# EAGLE design DATALOGGER_POWER_V1 (EAGLE 9.5.1)
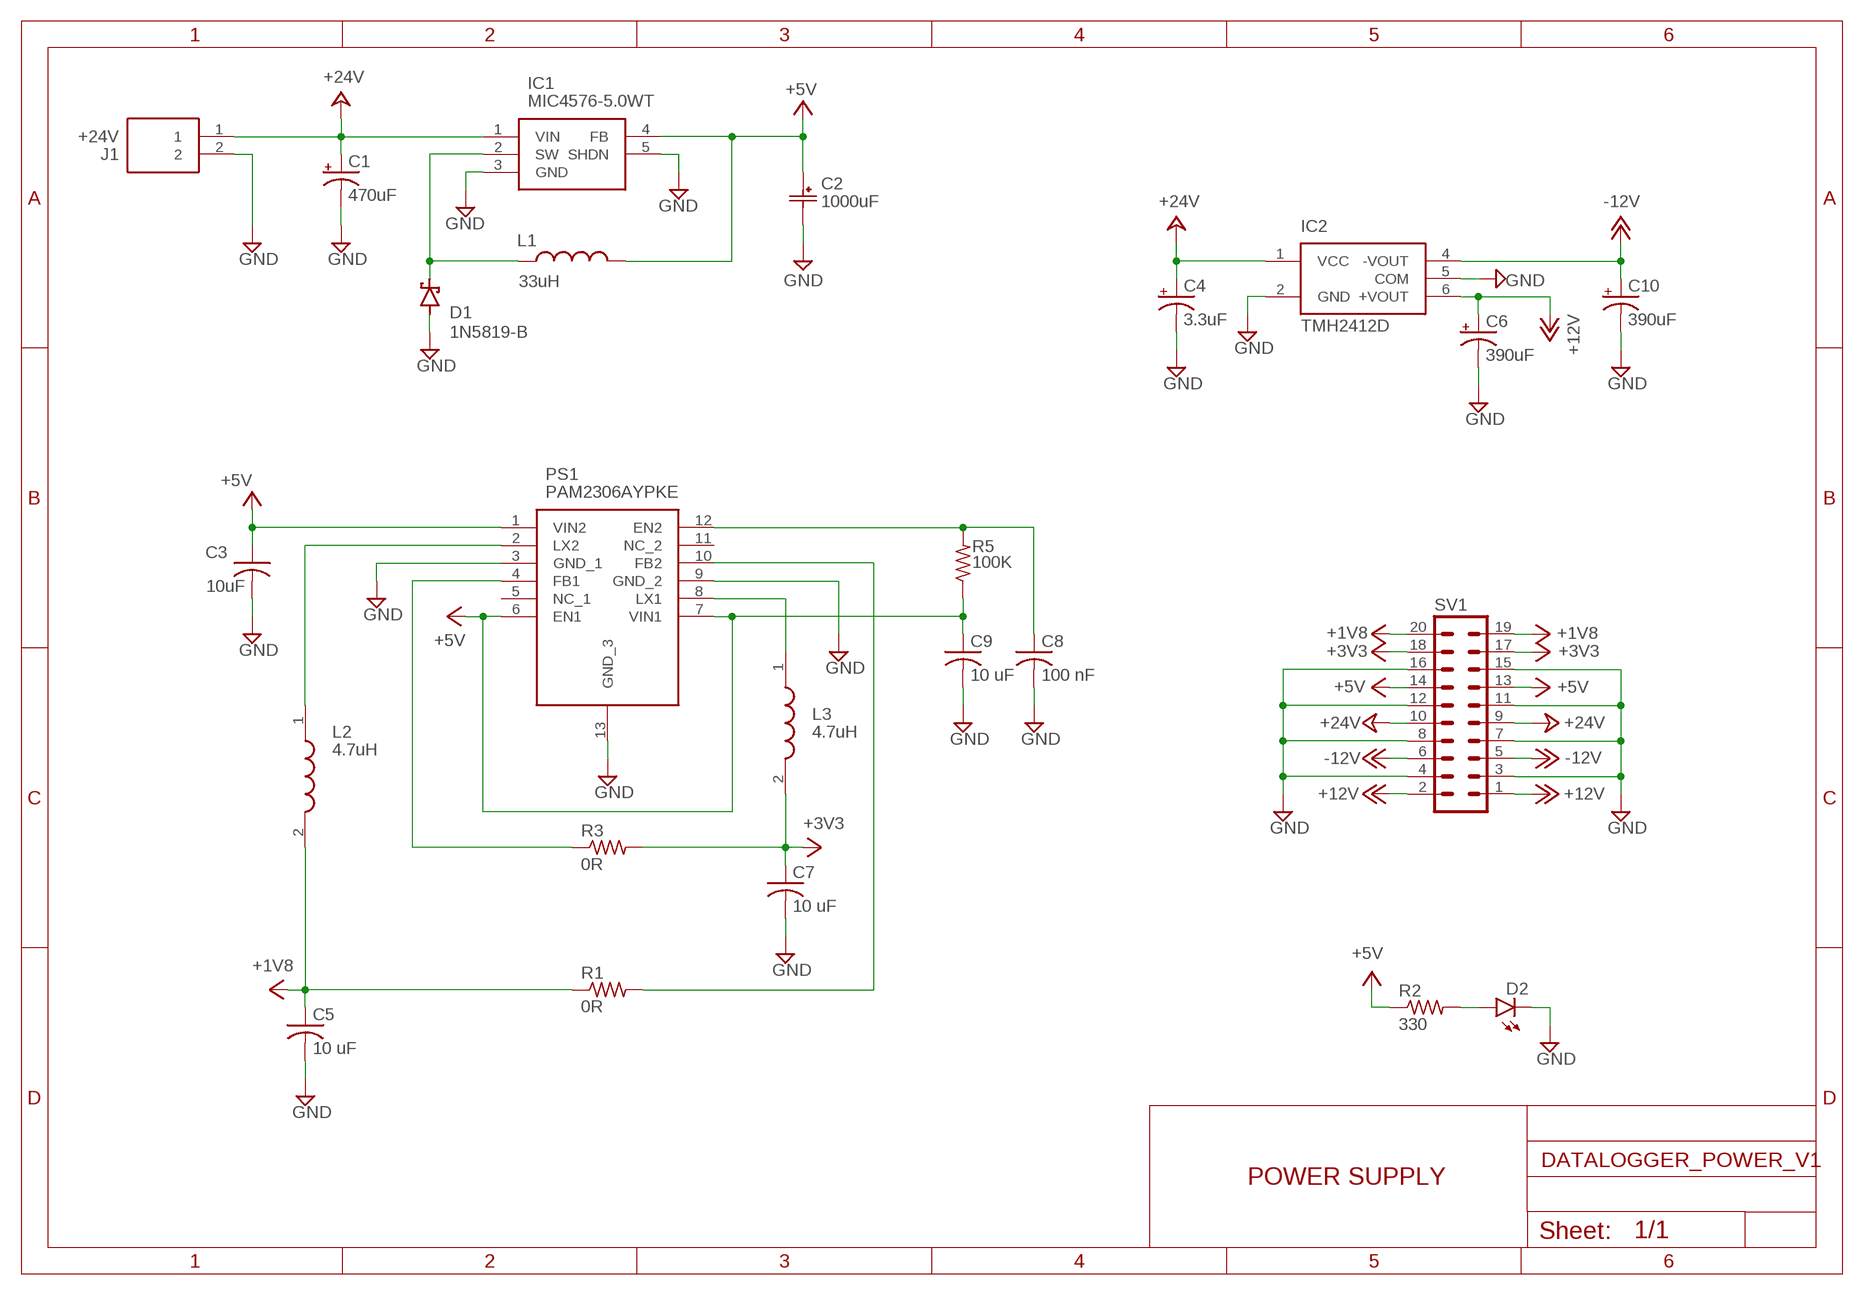
[diagram p0: schematic, sheet 1]

## Parts
C1  470uF  CPOL-USE5-13  [E5-13]
C2  1000uF  UCZ1V102MNQ1MS  [CAP_UCD_16X16P5_NCH]
C3  10uF  C-USC1206  [C1206]
C4  3.3uF  CPOL-USE2-4  [E2-4]
C5  10 uF  C-USC1206  [C1206]
C6  390uF  CPOL-USE2-4  [E2-4]
C7  10 uF  C-USC1206  [C1206]
C8  100 nF  C-USC1206  [C1206]
C9  10 uF  C-USC1206  [C1206]
C10  390uF  CPOL-USE2-4  [E2-4]
D1  1N5819-B  [DO41-7.6]
D2  LEDCHIPLED_1206  [CHIPLED_1206]
IC1  MIC4576-5.0WT  [TO170P470X1016X1600-5P]
IC2  TMH2412D  [TMH2412D]
J1  +24V  1711026  [SHDR2W110P0X500_1X2_1000X1120X]
L1  33uH  HCMA1707-330-R  [HCMA1707-330-R]
L2  4.7uH  SRN4018-4R7M  [SRN4018]
L3  4.7uH  SRN4018-4R7M  [SRN4018]
PS1  PAM2306AYPKE  [SON45P300X300X80-13N]
R1  0R  R-US_R1206  [R1206]
R2  330  R-US_R1206  [R1206]
R3  0R  R-US_R1206  [R1206]
R5  100K  R-US_R1206  [R1206]
SV1  MA10-2  [MA10-2]

## Nets
+1V8: C5.1 L2.2 R1.1 SV1.19 SV1.20
+3V3: C7.1 L3.2 R3.2 SV1.17 SV1.18
+5V: C2.1 C3.1 C9.1 IC1.4(FB) L1.2 PS1.1(VIN2) PS1.6(EN1) PS1.7(VIN1) R2.1 R5.1 SV1.13 SV1.14
+12V: C6.+ IC2.6(+VOUT) SV1.1 SV1.2
+24V: C1.+ C4.+ IC1.1(VIN) IC2.1(VCC) J1.1 SV1.9 SV1.10
-12V: C10.+ IC2.4(-VOUT) SV1.5 SV1.6
GND: C1.- C2.2 C3.2 C4.- C5.2 C6.- C7.2 C8.2 C9.2 C10.- D1.A D2.C IC1.3(GND) IC1.5(SHDN) IC2.2(GND) IC2.5(COM) J1.2 PS1.3(GND_1) PS1.9(GND_2) PS1.13(GND_3) SV1.3 SV1.4 SV1.7 SV1.8 SV1.11 SV1.12 SV1.15 SV1.16
N$1: D2.A R2.2
N$2: D1.C IC1.2(SW) L1.1
N$4: L3.1 PS1.8(LX1)
N$5: L2.1 PS1.2(LX2)
N$6: PS1.10(FB2) R1.2
N$8: PS1.4(FB1) R3.1
N$10: C8.1 PS1.12(EN2) R5.2
Unconnected: PS1.5(NC_1) PS1.11(NC_2)

## Notes on the sheet
- POWER SUPPLY

## Library data of the parts
C1 C4 C6 C10 = rcl:CPOL-US: POLARIZED CAPACITOR, American symbol; SPICEPREFIX: C
C2 = UCZ1V102MNQ1MS:UCZ1V102MNQ1MS; BUILT_BY: EMA_Cory; COPYRIGHT: Copyright (C) 2018 Accelerated Designs. All rights reserved; MANUFACTURER_PART_NUMBER: UCZ1V102MNQ1MS; SOURCELIBRARY: Nichicon_2019-09-13; VENDOR: Nichicon
C3 C5 C7-C9 = rcl:C-US: CAPACITOR, American symbol
D1 = diode:1N581*: 1.0A SCHOTTKY BARRIER RECTIFIER Source: http://www.diodes.com/datasheets/ds23001.pdf
D2 = led:LED: LED OSRAM: - CHIPLED LG R971, LG N971, LY N971, LG Q971, LY Q971, LO R971, LY R971 LH N974, LH R974 LS Q976, LO Q976, LY Q976 LO Q996 - Hyper CHIPLED LW Q18S LB Q993, LB Q99A, LB R99A - SideLED LS A670, LO A670, LY A670, LG A670, LP A670 LB A673, LV A673, LT A673, LW A673 LH A674 LY A675 LS A676, LA A676, LO A676, LY A676, LW A676 LS A679, LY A679, LG A679 - Hyper Micro SIDELED® LS Y876, LA Y876, LO Y876, LY Y876 LT Y87S - SmartLED LW L88C, LW L88S LB L89C, LB L89S, LG L890 LS L89K, LO L89K, LY L89K LS L896, LA L896, LO L896, LY L896 - TOPLED LS T670, LO T670, LY T670, LG T670, LP T670 LSG T670, LSP T670, LSY T670, LOP T670, LYG T670 LG T671, LOG T671, LSG T671 LB T673, LV T673, LT T673, LW T673 LH T674 LS T676, LA T676, LO T676, LY T676, LB T676, LH T676, LSB T676, LW T676 LB T67C, LV T67C, LT T67C, LS T67K, LO T67K, LY T67K, LW E67C LS E67B, LA E67B, LO E67B, LY E67B, LB E67C, LV E67C, LT E67C LW T67C LS T679, LY T679, LG T679 LS T770, LO T770, LY T770, LG T770, LP T770 LB T773, LV T773, LT T773, LW T773 LH T774 LS E675, LA E675, LY E675, LS T675 LS T776, LA T776, LO T776, LY T776, LB T776 LHGB T686 LT T68C, LB T68C - Hyper Mini TOPLED® LB M676 - Mini TOPLED Santana® LG M470 LS M47K, LO M47K, LY M47K Source: http://www.osram.convergy.de LUXEON: - LUMILED® LXK2-PW12-R00, LXK2-PW12-S00, LXK2-PW14-U00, LXK2-PW14-V00 LXK2-PM12-R00, LXK2-PM12-S00, LXK2-PM14-U00 LXK2-PE12-Q00, LXK2-PE12-R00, LXK2-PE12-S00, LXK2-PE14-T00, LXK2-PE14-U00 LXK2-PB12-K00, LXK2-PB12-L00, LXK2-PB12-M00, LXK2-PB14-N00, LXK2-PB14-P00, LXK2-PB14-Q00 LXK2-PR12-L00, LXK2-PR12-M00, LXK2-PR14-Q00, LXK2-PR14-R00 LXK2-PD12-Q00, LXK2-PD12-R00, LXK2-PD12-S00 LXK2-PH12-R00, LXK2-PH12-S00 LXK2-PL12-P00, LXK2-PL12-Q00, LXK2-PL12-R00 Source: www.luxeon.com KINGBRIGHT: KA-3528ASYC Source: www.kingbright.com
IC1 = SamacSys_Parts:MIC4576-5.0WT: Switching Voltage Regulators 200kHz 3.0A Step-down Regulator Source: Datasheet <http://ww1.microchip.com/downloads/en/devicedoc/mic4576.pdf>; DESCRIPTION: Switching Voltage Regulators 200kHz 3.0A Step-down Regulator; HEIGHT: 4.7mm; MANUFACTURER_NAME: Microchip; MANUFACTURER_PART_NUMBER: MIC4576-5.0WT; MOUSER_PART_NUMBER: 998-MIC4576-5.0WT; MOUSER_PRICE-STOCK: https://www.mouser.co.uk/ProductDetail/Microchip-Technology-Micrel/MIC4576-50WT?qs=kh6iOki%2FeLEIhSt6WnGdnw%3D%3D
IC2 = TMH 2412D:TMH2412D
J1 = SamacSys_Parts:1711026: CONNECTOR Phoenix Contact PCB Terminal Block, 2 Way, 30 12 AWG, Polyamide, 630 V Source: Datasheet <https://componentsearchengine.com/Datasheets/1/1711026.pdf>; DESCRIPTION: CONNECTOR Phoenix Contact PCB Terminal Block, 2 Way, 30 12 AWG, Polyamide, 630 V; HEIGHT: 18mm; MANUFACTURER_NAME: Phoenix Contact; MANUFACTURER_PART_NUMBER: 1711026; MOUSER_PART_NUMBER: 651-1711026; MOUSER_PRICE-STOCK: https://www.mouser.com/Search/Refine.aspx?Keyword=651-1711026
L1 = HCMA1707-330-R2:HCMA1707-330-R
L2 L3 = SamacSys_Parts:SRN4018-4R7M: Inductor SMD 4x4 semi-shielded 4,7uH Bourns SRN4018 Series Shielded Wire-wound SMD Inductor with a Ferrite Core, 4.7 uH +/-20% Wire-Wound 1.9A rms Idc Source: Datasheet <https://componentsearchengine.com/Datasheets/1/SRN4018-4R7M.pdf>; DESCRIPTION: Inductor SMD 4x4 semi-shielded 4,7uH Bourns SRN4018 Series Shielded Wire-wound SMD Inductor with a Ferrite Core, 4.7 uH +/-20% Wire-Wound 1.9A rms Idc; HEIGHT: mm; MANUFACTURER_NAME: Bourns; MANUFACTURER_PART_NUMBER: SRN4018-4R7M; MOUSER_PART_NUMBER: 652-SRN4018-4R7M; MOUSER_PRICE-STOCK: https://www.mouser.com/Search/Refine.aspx?Keyword=652-SRN4018-4R7M
PS1 = SamacSys_Parts:PAM2306AYPKE: DUAL PWM ST-DOWN DC-DC CONVerter DiodesZetex PAM2306AYPKE, Dual Step Down DC-DC Converter, 1A, Maximum of 3.3 V, 12-Pin WDFN Source: Datasheet <https://componentsearchengine.com/Datasheets/1/PAM2306AYPKE.pdf>; DESCRIPTION: DUAL PWM ST-DOWN DC-DC CONVerter DiodesZetex PAM2306AYPKE, Dual Step Down DC-DC Converter, 1A, Maximum of 3.3 V, 12-Pin WDFN; HEIGHT: 0.8mm; MANUFACTURER_NAME: Diodes Inc.; MANUFACTURER_PART_NUMBER: PAM2306AYPKE; MOUSER_PART_NUMBER: 621-PAM2306AYPKE; MOUSER_PRICE-STOCK: https://www.mouser.com/Search/Refine.aspx?Keyword=621-PAM2306AYPKE; RS_PART_NUMBER: 9210751P; RS_PRICE-STOCK: http://uk.rs-online.com/web/p/products/9210751P
R1-R3 R5 = rcl:R-US_: RESISTOR, American symbol; SPICEPREFIX: R
SV1 = con-lstb:MA10-2: PIN HEADER; OC_FARNELL: unknown; OC_NEWARK: unknown

## Board
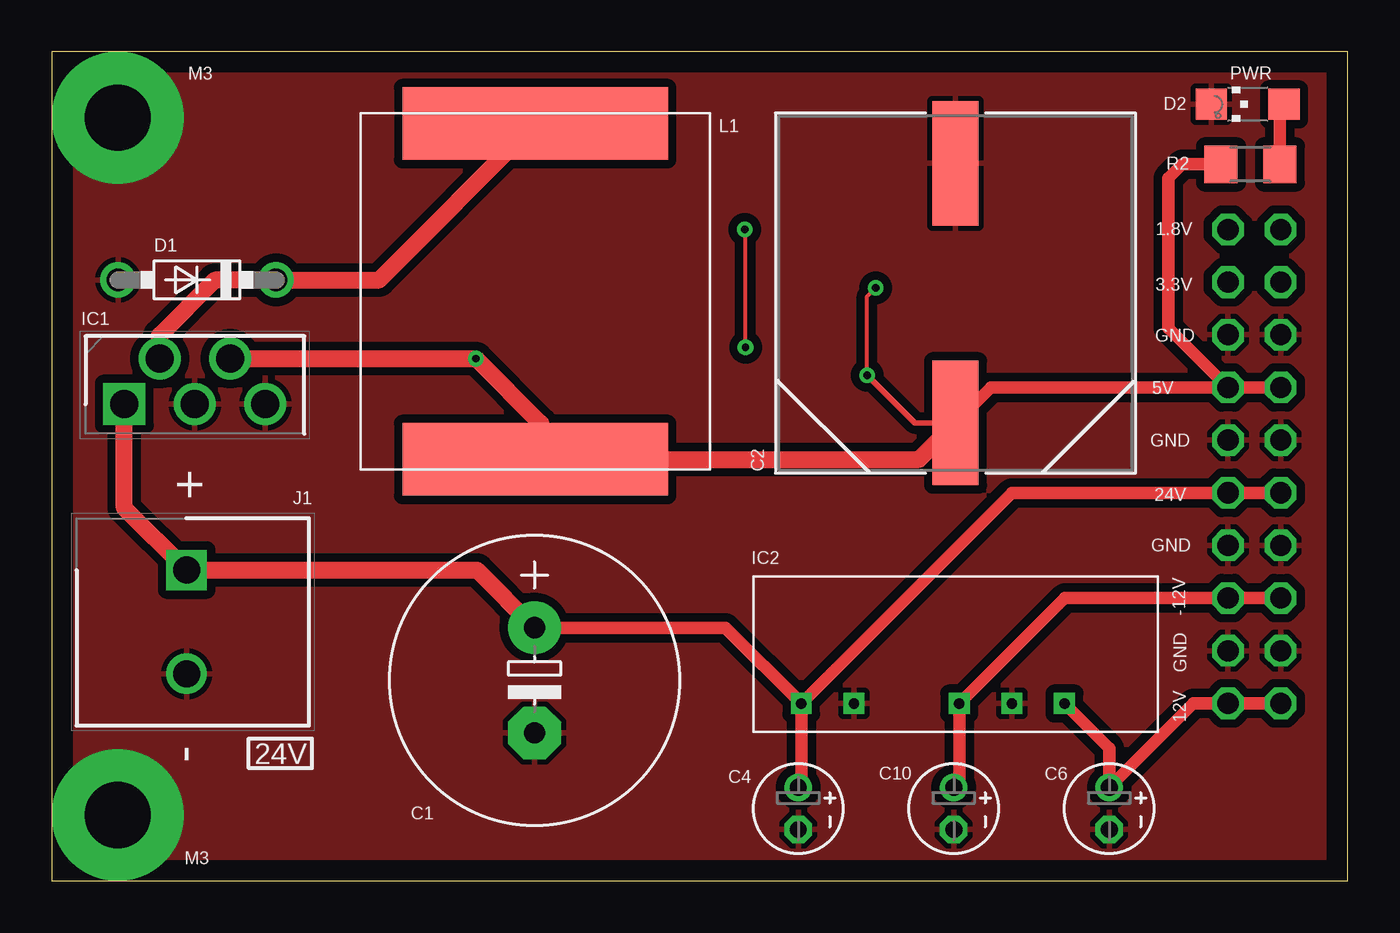
[diagram p1: board, top side]
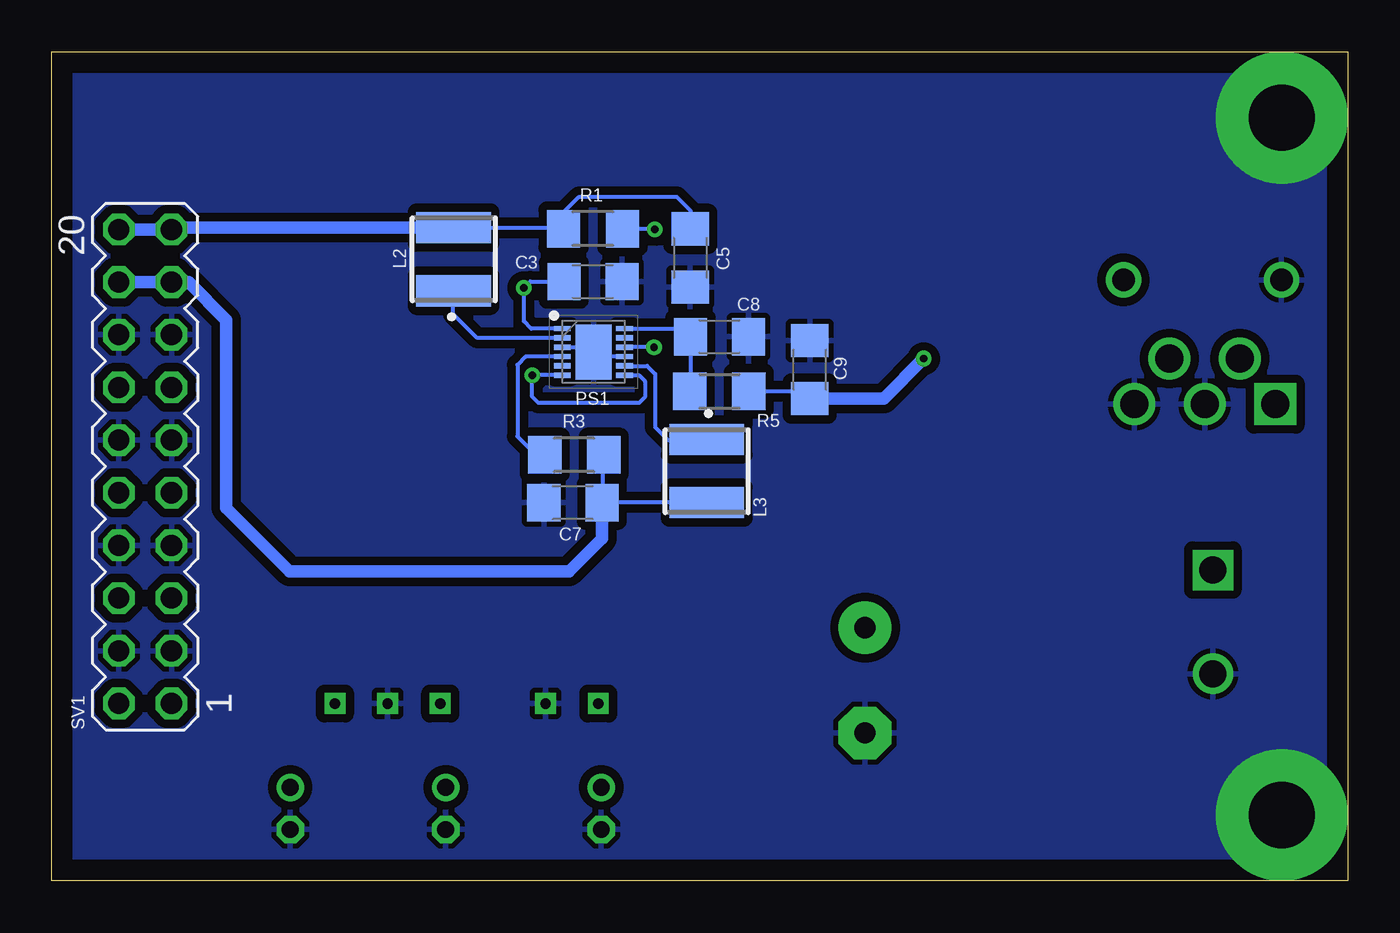
[diagram p2: board, bottom side, seen from below]

Size 62.5 x 40 mm. Coordinates in mm from the lower left corner, seen from the top.
Outline: 0,0 62.5,0 62.5,40 0,40 0,0
Copper layers (1*16): Top 0.035mm / dielectric 1.5mm / Bottom 0.035mm
Design rules "default": minimum track width 6mil, minimum drill 0.35mm, track to track 6mil, track to pad 6mil, pad to pad 6mil, via to via 6mil, smd to smd 6mil, copper to edge 40mil, drill to drill 6mil, minimum pad ring 10mil, minimum via ring 8mil, stop-mask expansion 4mil, vias tented up to drill 0mil, thermal gap 10mil

### Footprints (pad centres in the part's own frame; a part is rotated, then mirrored left to right if it is on the bottom)
E5-13 = drill 1.016 pad 2.54: + -2.54,0 | drill 1.016 pad 2.54 octagon: - 2.54,0
CAP_UCD_16X16P5_NCH = smd 5.994 x 2.21: 1 -6.261,0; 2 6.261,0
C1206 = smd 1.6 x 1.8: 1 -1.4,0; 2 1.4,0
E2-4 = drill 0.813 pad 1.27: + -1.016,0 | drill 0.813 pad 1.27 octagon: - 1.016,0
DO41-7.6 = drill 1.1 pad 1.7: A 3.81,0; C -3.81,0
CHIPLED_1206 = smd 1.5 x 1.5: A 0,-1.75; C 0,1.75
TO170P470X1016X1600-5P = drill 1.35 pad 2.025 square: 1 0,0 | drill 1.35 pad 2.025: 2 1.7,2.2; 3 3.4,0; 4 5.1,2.2; 5 6.8,0
TMH2412D = drill 0.5 square: 1 2.3,1.375; 2 4.84,1.375; 4 9.92,1.375; 5 12.46,1.375; 6 15,1.375
SHDR2W110P0X500_1X2_1000X1120X = drill 1.3 pad 1.95 square: 1 0,0 | drill 1.3 pad 1.95: 2 5,0
HCMA1707-330-R = smd 3.5 x 12.8: 1 0.5,-8.425; 2 16.7,-8.425
SRN4018 = smd 1.5 x 3.6: 1 -1.525,0; 2 1.525,0
SON45P300X300X80-13N = smd 0.8 x 0.25: 1 -1.5,1.125; 2 -1.5,0.675; 3 -1.5,0.225; 4 -1.5,-0.225; 5 -1.5,-0.675; 6 -1.5,-1.125; 7 1.5,-1.125; 8 1.5,-0.675; 9 1.5,-0.225; 10 1.5,0.225; 11 1.5,0.675; 12 1.5,1.125 | smd 1.75 x 2.65: 13 0,0
R1206 = smd 1.6 x 1.803: 1 -1.422,0; 2 1.422,0
MA10-2 = drill 1.016 octagon: 1 -11.43,-1.27; 2 -11.43,1.27; 3 -8.89,-1.27; 4 -8.89,1.27; 5 -6.35,-1.27; 6 -6.35,1.27; 7 -3.81,-1.27; 8 -3.81,1.27; 9 -1.27,-1.27; 10 -1.27,1.27; 11 1.27,-1.27; 12 1.27,1.27; 13 3.81,-1.27; 14 3.81,1.27; 15 6.35,-1.27; 16 6.35,1.27; 17 8.89,-1.27; 18 8.89,1.27; 19 11.43,-1.27; 20 11.43,1.27

### Placement (x,y rotation side)
C1  23.28,9.68 270 top
C2  43.59,28.36 90 top
C3  36.4,28.91 0 bottom
C4  36,3.5 270 top
C5  31.71,30.06 270 bottom
C6  51,3.5 270 top
C7  37.37,18.25 180 bottom
C8  30.3,26.26 0 bottom
C9  25.94,24.67 90 bottom
C10  43.5,3.5 270 top
D1  7,29 180 top
D2  57.68,37.47 90 top
IC1  3.5,23 0 top
IC2  33.85,7.18 0 top
J1  6.5,15 270 top
L1  31.74,37.04 270 top
L2  43.12,30 90 bottom
L3  30.91,19.78 270 bottom
PS1  36.38,25.52 0 bottom
R1  36.4,31.47 0 bottom
R2  57.81,34.57 0 top
R3  37.3,20.56 0 bottom
R5  30.31,23.63 180 bottom
SV1  58,20 90 bottom

### Tracks (layer width: path | path; a pad name or v marks a point on that pad's centre or on a via)
+1V8
  Bottom 0.2: L2.2 37.88,31.52 R1.1 37.82,32.26 37.07,33.01 32.37,33.01 31.7,32.34 C5.1
  Bottom 0.61: L2.2 57.02,31.52 SV1.19 SV1.20
+3V3
  Bottom 0.2: L3.2 C7.1 | C7.1 | R3.2 35.94,20.5 35.94,18.28 C7.1
  Bottom 0.61: C7.1 35.97,16.53 37.56,14.94 51.03,14.94 54.09,18 54.09,27.07 55.91,28.89 SV1.17 SV1.18
+5V  (via drill 0.35)
  Top 0.2: v39.32,24.4 39.32,28.2 v39.73,28.61
  Top 0.254: v39.32,24.4 41.62,22.1 C2.1
  Top 0.61: C2.1 45.3,23.81 SV1.13 | SV1.13 SV1.14 | R2.1 54.52,34.57 53.86,33.91 53.86,26.68 SV1.13
  Top 0.813: IC1.4 v20.45,25.2 23.58,22.07 23.58,20.6 L1.2 41.83,20.34 C2.1
  Bottom 0.2: PS1.1 39.38,26.65 39.73,27 v39.73,28.61 39.42,28.92 C3.1 | PS1.6 v39.32,24.4 | v39.32,24.4 | R5.1 26.3,23.63 C9.1 | PS1.7 34.18,24.4 33.89,24.11 33.89,23.34 34.17,23.06 39.03,23.06 39.33,23.36 39.33,24.39 v39.32,24.4
  Bottom 0.61: C9.1 22.38,23.27 v20.45,25.2
+12V
  Top 0.61: IC2.6 51,6.41 C6.+ 55.05,8.57 SV1.1 SV1.2
+24V
  Top 0.61: IC2.1 32.48,12.22 C1.+ | IC2.1 36.15,4.66 C4.+ | IC2.1 46.31,18.73 SV1.9 SV1.10
  Top 0.813: IC1.1 3.5,18 J1.1 20.5,15 C1.+
-12V
  Top 0.61: C10.+ 43.77,4.78 IC2.4 48.85,13.65 SV1.5 SV1.6
GND  (via drill 3.2 pad 6.35)
  Bottom 0.2: PS1.9 36.15,25.3 PS1.13 36.6,25.75 PS1.3
  other vias: 3.17,36.83 3.17,3.17
  pour Top (isolate 0.406): 0,40 0,0 62.5,0 62.5,40
  pour Bottom (isolate 0.406): 0,40 0,0 62.5,0 62.5,40
N$1
  Top 0.61: R2.2 59.23,37.27 D2.A
N$2
  Top 0.813: IC1.2 5.2,26.32 7.86,28.98 10.79,28.98 D1.C 15.78,29 L1.1
N$4
  Bottom 0.2: PS1.8 33.79,24.85 33.4,24.46 33.4,21.89 32.78,21.27 30.95,21.27 L3.1
N$5
  Bottom 0.2: PS1.2 41.99,26.2 43.14,27.35 43.14,28.45 L2.1
N$6  (via drill 0.35)
  Top 0.2: v33.42,31.44 33.42,25.79 v33.46,25.75
  Bottom 0.2: R1.2 33.45,31.47 v33.42,31.44 | v33.46,25.75 PS1.10
N$8
  Bottom 0.2: PS1.4 39.64,25.3 40.04,24.9 40.04,21.45 39.14,20.55 R3.1
N$10
  Bottom 0.2: PS1.12 32.09,26.65 C8.1 31.7,23.66 R5.2

### Text on the board
tPlace: M3 | PWR | 1.8V | 3.3V | GND | 5V | GND | + | 24V | GND | -12V | GND | 12V | 24V | - | M3